# Altium schematic sheet 9V_Converter.SchDoc
size A
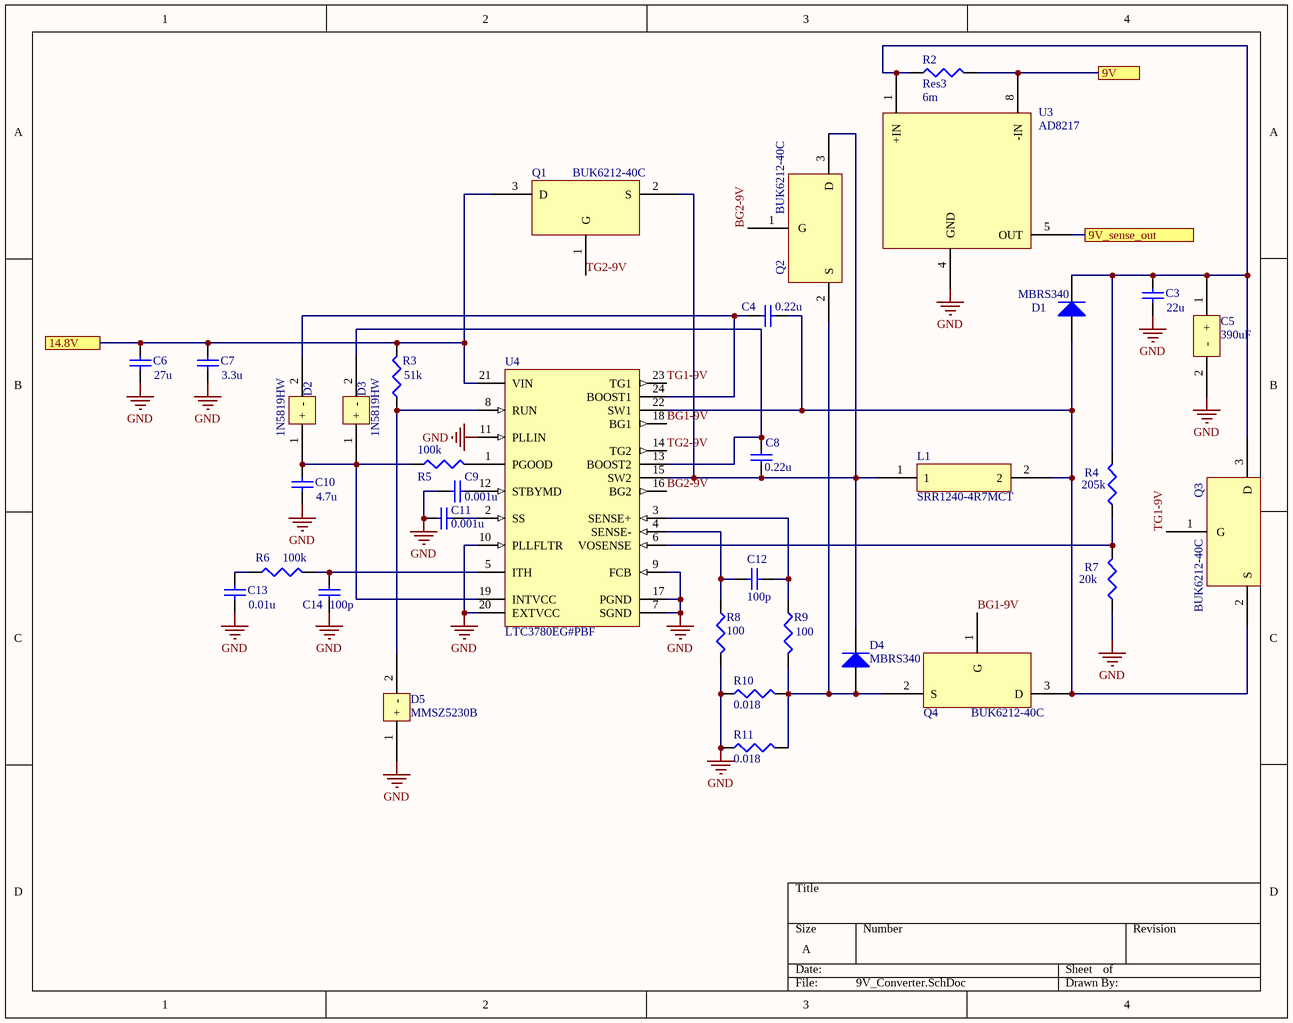
[diagram p0: 9V_Converter.SchDoc]

## Parts
C3  value 22u  [C1206]  (hidden comment: Cap Semi)
C4  value 0.22u  [C1206]  (hidden comment: Cap Semi)
C5  390uF  [PCV1E391MCL2GS]
C6  value 27u  [C1206]  (hidden comment: Cap Semi)
C7  value 3.3u  [C1206]  (hidden comment: Cap Semi)
C8  value 0.22u  [C1206]  (hidden comment: Cap Semi)
C9  value 0.001u  [C1206]  (hidden comment: Cap Semi)
C10  value 4.7u  [C1206]  (hidden comment: Cap Semi)
C11  value 0.001u  [C1206]  (hidden comment: Cap Semi)
C12  value 100p  [C1206]  (hidden comment: Cap Semi)
C13  value 0.01u  [C1206]  (hidden comment: Cap Semi)
C14  value 100p  [C1206]  (hidden comment: Cap Semi)
D1  MBRS340  [SMC]
D2  1N5819HW  [1N5819HW]
D3  1N5819HW  [1N5819HW]
D4  MBRS340  [SMC]
D5  MMSZ5230B  [MMSZ5230B]
L1  SRR1240-4R7MCT  [SRR1240-4R7M]
Q1  BUK6212-40C  [BUK6212-40C]
Q2  BUK6212-40C  [BUK6212-40C]
Q3  BUK6212-40C  [BUK6212-40C]
Q4  BUK6212-40C  [BUK6212-40C]
R2  Res3  value 6m  [14-1210]
R3  value 51k  [J1-0603]  (hidden comment: Res3)
R4  value 205k  [J1-0603]  (hidden comment: Res3)
R5  value 100k  [J1-0603]  (hidden comment: Res3)
R6  value 100k  [J1-0603]  (hidden comment: Res3)
R7  value 20k  [J1-0603]  (hidden comment: Res3)
R8  value 100  [J1-0603]  (hidden comment: Res3)
R9  value 100  [J1-0603]  (hidden comment: Res3)
R10  value 0.018  [14-1210]  (hidden comment: Res3)
R11  value 0.018  [14-1210]  (hidden comment: Res3)
U3  AD8217  [AD8217]
U4  LTC3780EG#PBF  [LTC3780 24-Leaqd Plastic SSOP]

## Ports
9V, 9V_sense_out, 14.8V

## Nets
GND: C3.1 C5.2(-) C6.1 C7.1 C9.1 C10.1 C11.1 C13.1 C14.1 D5.1(+) R7.1 R8.2 R10.1 R11.1 U3.4(GND) U4.7(SGND) U4.9(FCB) U4.10(PLLFLTR) U4.11(PLLIN) U4.17(PGND) U4.20(EXTVCC)
9V: R2.2 U3.8(-IN) ; port 9V
9V_sense_out: U3.5(OUT) ; port 9V_sense_out
14.8V: C6.2 C7.2 Q1.3(D) R3.2 U4.21(VIN) ; port 14.8V
BG1-9V: Q4.1(G) U4.18(BG1)
BG2-9V: Q2.1(G) U4.16(BG2)
TG1-9V: Q3.1(G) U4.23(TG1)
TG2-9V: Q1.1(G) U4.14(TG2)
NetC3_2: C3.2 C5.1(+) D1.2(K) Q3.3(D) R2.1 R4.2 U3.1(+IN)
NetC4_1: C4.1 D1.1(A) L1.2 Q3.2(S) Q4.3(D) U4.22(SW1)
NetC4_2: C4.2 D2.2(-) U4.24(BOOST1)
NetC8_1: C8.1 D4.2(K) L1.1 Q1.2(S) Q2.3(D) U4.15(SW2)
NetC8_2: C8.2 D3.2(-) U4.13(BOOST2)
NetC9_2: C9.2 U4.12(STBYMD)
NetC10_2: C10.2 D2.1(+) D3.1(+) R5.1 U4.19(INTVCC)
NetC11_2: C11.2 U4.2(SS)
NetC12_1: C12.1 R8.1 U4.4(SENSE-)
NetC12_2: C12.2 R9.1 U4.3(SENSE+)
NetC13_2: C13.2 R6.1
NetC14_2: C14.2 R6.2 U4.5(ITH)
NetD4_1: D4.1(A) Q2.2(S) Q4.2(S) R9.2 R10.2 R11.2
NetD5_2: D5.2(-) R3.1 U4.8(RUN)
NetR4_1: R4.1 R7.2 U4.6(VOSENSE)
NetR5_2: R5.2 U4.1(PGOOD)

## Library data of the parts
C3 C4 C6-C14 = Cap Semi: Capacitor (Semiconductor SIM Model); Published: 8-Jun-2000; LatestRevisionDate: 29-May-2009; LatestRevisionNote: IPC-7351 Footprint Added.; PackageReference: C1206; Publisher: Altium Limited; PackageDescription: Chip Capacitor
C5 = PCV1E391MCL2GS: Aluminum Capacitor
D1 D4 = Diode: Default Diode; Published: 8-Jun-2000; LatestRevisionDate: 17-Jul-2002; LatestRevisionNote: Re-released for DXP Platform.; PackageVersion: Sep-1996; PackageReference: SMC; Publisher: Altium Limited; PackageDescription: DO-214-AB/SMC; 2 C-Bend Leads; Body 7.9 x 5.9 mm, inc. leads (LxW); Code_JEDEC: DO-214-AB
D2 D3 = 1N5819HW: 1A Schottky Barrier Rectifier
D5 = MMSZ5230B: Zener Diode
L1 = SRR1240-4R7MCT: Inductor
Q1-Q4 = BUK6212-40C: N-Channel TrenchMOS Intermediate Level FET
R2-R11 = Res3: Resistor; Published: 8-Jun-2000; LatestRevisionDate: 29-May-2009; LatestRevisionNote: IPC-7351 Footprint Added.; PackageReference: J1-0603; Publisher: Altium Limited; PackageDescription: Chip Resistor
U3 = AD8217: Current Shunt Moniter
U4 = LTC3780EG#PBF: Buck-boost Controller, Constant Frequency, Current Mode Control with Power Good Output, 24-pin SOP (G-24), -40 to 85 degC, Pb-Free; Manufacturer: Linear Technology; Frequency Sync Range: 200kHz - 400kHz; Number of Outputs: 1; PackageDesciption: 24-Pin Plastic SSOP, Body 8.2 x 5.3 mm, Pitch 0.65 mm; ComponentLink1Description: Manufacturer URL; ComponentLink1URL: http://www.linear.com/; ComponentLink2Description: Datasheet; ComponentLink2URL: http://cds.linear.com/docs/en/datasheet/3780ff.pdf; ComponentLink3Description: Package Specification; ComponentLink3URL: http://cds.linear.com/docs/en/packaging/SSOP_24_05-08-1640.pdf; DatasheetVersion: Rev. F; Mounting Technology: Surface Mount; PackageReference: G-24; PackageVersion: Jun-10; PartNumber: LTC3780EG#PBF; RoHS: TRUE; Supplier 1: Digi-Key; Supplier 2: Farnell; Supplier 3: Newark; Supplier Part Number 1: LTC3780EG#PBF-ND; Supplier Part Number 2: 1273545; Supplier Part Number 3: 56M8395